# Altium project NG2093.PrjPcb (part 10 of 10)
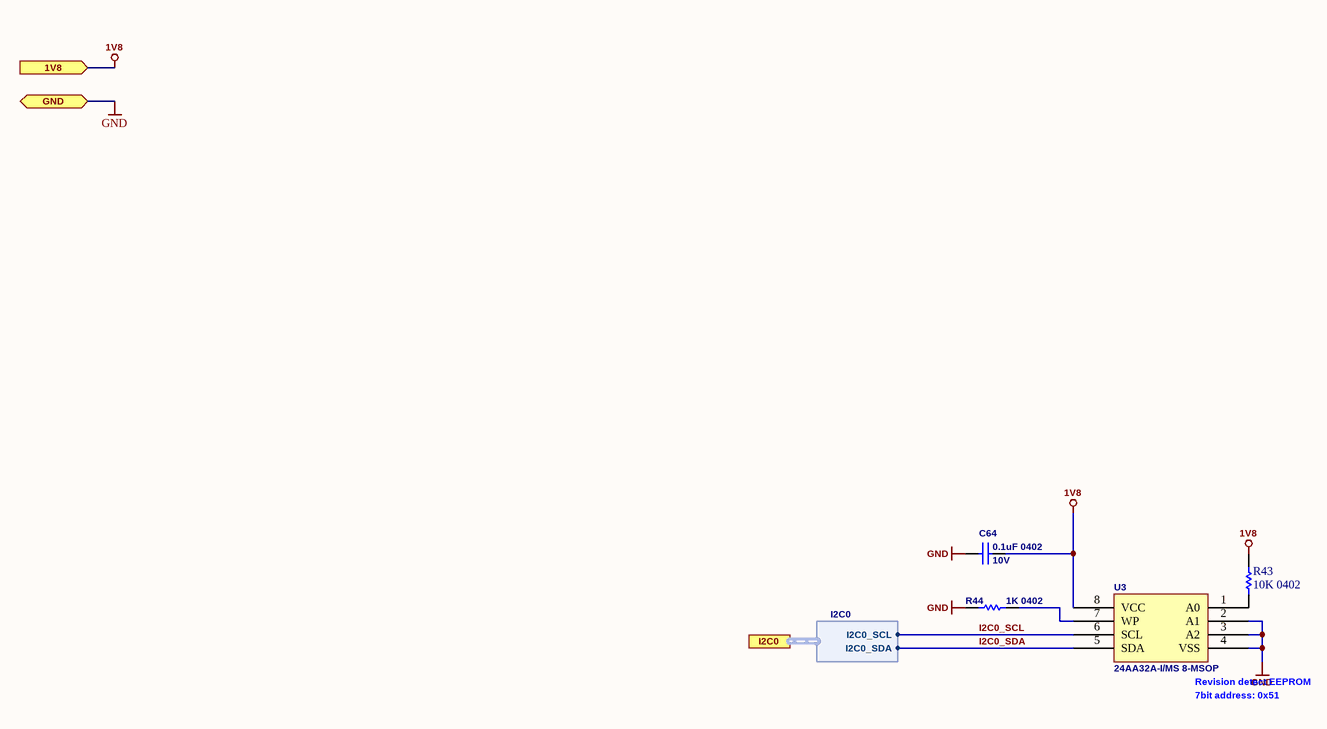
[diagram p18: NG9093_EEPROM.SchDoc]

## Nets that join several sheets
1V2: POWER_GEN (R64.2), Ethernet_Switch (20 pins)
1V8: CONNECTOR_B (C65.2 U11.5), ETH_PCIE_PHY (C52.2 R50.2 U6.3), BOOT_JTAG_AUX (9 pins), POWER_GEN (C63.2 TP3.1 U8.5), NG2093_IMU (8 pins), NG9093_EEPROM (C64.2 R43.2 U3.8)
2V5: POWER_GEN (R94.2), Ethernet_Switch (10 pins)
3V3: ETH_PCIE_PHY (21 pins), NG2093_USB (7 pins), BOOT_JTAG_AUX (C55.2 J4.9 J7.4), POWER_GEN (15 pins), NG2093_IMU (C90.2 C91.2 U12.3), RJ45_1 (J1.15 J1.17), RJ45_2 (J10.15 J10.17), NG2093_CAM_2Lane (J6.25 J6.26 J8.25 J8.26), Ethernet_Switch (21 pins), PoE_Si3404 (R57.2), NG2093_CAM_4Lane (J9.25 J9.26 J11.25 J11.26)
5V_PoE: CONNECTOR_B (8 pins), CONNECTOR_A (J12.1), BOOT_JTAG_AUX (R53.2 R54.2 R55.2 R56.2), POWER_GEN (8 pins), PoE_Si3404 (7 pins)
GND: TopLevel (6 pins), CONNECTOR_B (29 pins), CONNECTOR_A (28 pins), ETH_PCIE_PHY (24 pins), NG2093_USB (26 pins), BOOT_JTAG_AUX (21 pins), POWER_GEN (24 pins), NG2093_IMU (10 pins), RJ45_1 (7 pins), RJ45_2 (7 pins), NG2093_CAM_2Lane (26 pins), Ethernet_Switch (65 pins), PoE_Si3404 (10 pins), NG2093_CAM_4Lane (32 pins), NG9093_EEPROM (5 pins)
VBUS: CONNECTOR_B (J3.80), NG2093_USB (14 pins)
VNEG_IN: RJ45_1 (6 pins), PoE_Si3404 (C33.1 FB3.1 NT1.1)
2485_BOOT_SEL: CONNECTOR_A (J12.4), BOOT_JTAG_AUX (B2.2 R102.2 R103.2)
2485_PGOOD: CONNECTOR_A (J2.37), BOOT_JTAG_AUX (J5.5 Q2.1)
2485_WAKEUP: CONNECTOR_A (J2.41), BOOT_JTAG_AUX (J5.7 R1.2 R62.2)
BNO08x_BOOTN_1V8: CONNECTOR_B (J3.42), NG2093_IMU (R84.2)
BNO08x_CIPO_1V8: CONNECTOR_A (J2.64 TP28.1), NG2093_IMU (U12.20)
BNO08x_COPI_1V8: CONNECTOR_A (J2.62 TP29.1), NG2093_IMU (U12.17)
BNO08x_CS_1V8: CONNECTOR_A (J2.60 TP30.1), NG2093_IMU (R95.2 U12.18)
BNO08x_INT_1V8: CONNECTOR_A (J2.69), NG2093_IMU (TP25.1 U12.14)
BNO08x_RSTn_1V8: CONNECTOR_B (J3.44), NG2093_IMU (TP19.1 U12.11)
BNO08x_SCK_1V8: CONNECTOR_A (J2.74 TP27.1), NG2093_IMU (U12.19)
BOOT0: CONNECTOR_B (J3.26), BOOT_JTAG_AUX (R23.1 R38.2 SW1.6)
BOOT1: CONNECTOR_B (J3.24), BOOT_JTAG_AUX (R22.1 R37.2 SW1.5)
BOOT2: CONNECTOR_B (J3.22), BOOT_JTAG_AUX (R21.1 R36.2 SW1.4)
BOOT3: CONNECTOR_B (J3.20), BOOT_JTAG_AUX (R20.1 R35.2 SW1.3)
BOOT4: CONNECTOR_B (J3.18), BOOT_JTAG_AUX (R19.1 R34.2 SW1.2)
CAM2_RST: CONNECTOR_B (J3.72), NG2093_CAM_4Lane (D12.4 D12.7 J11.17 TP16.1)
CAM_A_CLK_OUT: CONNECTOR_A (J2.28), NG2093_CAM_4Lane (7 pins)
CAM_A_PWDN_N: CONNECTOR_A (J2.34), NG2093_CAM_4Lane (D27.4 D27.7 J9.17 TP37.1)
CAM_B_CLK_OUT: CONNECTOR_A (J2.73), NG2093_CAM_2Lane (8 pins)
CAM_B_D_PWM: CONNECTOR_A (J2.65), NG2093_CAM_2Lane (D28.4 D28.7 J8.17 TP36.1)
CAM_B_PWDN_N: CONNECTOR_A (J2.67), NG2093_CAM_2Lane (D24.4 D24.7 J6.17 TP35.1)
CAM_L_C_N: CONNECTOR_A (J2.95), NG2093_CAM_2Lane (D24.1 D24.10 J6.8)
CAM_L_C_P: CONNECTOR_A (J2.97), NG2093_CAM_2Lane (D24.2 D24.9 J6.9)
CAM_L_D0_N: CONNECTOR_A (J2.89), NG2093_CAM_2Lane (D22.1 D22.10 J6.2)
CAM_L_D0_P: CONNECTOR_A (J2.91), NG2093_CAM_2Lane (D22.2 D22.9 J6.3)
CAM_L_D1_N: CONNECTOR_A (J2.83), NG2093_CAM_2Lane (D22.4 D22.7 J6.5)
CAM_L_D1_P: CONNECTOR_A (J2.85), NG2093_CAM_2Lane (D22.5 D22.6 J6.6)
CAM_R_C_N: CONNECTOR_A (J2.96), NG2093_CAM_2Lane (D28.1 D28.10 J8.8)
CAM_R_C_P: CONNECTOR_A (J2.98), NG2093_CAM_2Lane (D28.2 D28.9 J8.9)
CAM_R_D0_N: CONNECTOR_A (J2.90), NG2093_CAM_2Lane (D26.1 D26.10 J8.2)
CAM_R_D0_P: CONNECTOR_A (J2.92), NG2093_CAM_2Lane (D26.2 D26.9 J8.3)
CAM_R_D1_N: CONNECTOR_A (J2.84), NG2093_CAM_2Lane (D26.4 D26.7 J8.5)
CAM_R_D1_P: CONNECTOR_A (J2.86), NG2093_CAM_2Lane (D26.5 D26.6 J8.6)
COM_AUX_IO2: CONNECTOR_B (U11.1), CONNECTOR_A (R82.1 R100.1), NG2093_CAM_2Lane (R79.1 R80.1)
FSIN_4LANE: CONNECTOR_B (R99.1 U11.2), CONNECTOR_A (R101.1), NG2093_CAM_4Lane (R77.1 R81.1)
GPIO7/sd_hst_cd: CONNECTOR_A (J2.59), BOOT_JTAG_AUX (R66.2)
GPIO58: CONNECTOR_B (J3.28 R27.1), BOOT_JTAG_AUX (R33.2 R63.1 SW1.1)
I2C0_SCL: CONNECTOR_B (J3.34), BOOT_JTAG_AUX (TP1.1), NG9093_EEPROM (U3.6)
I2C0_SDA: CONNECTOR_B (J3.36), BOOT_JTAG_AUX (TP2.1), NG9093_EEPROM (U3.5)
I2C1_SCL: CONNECTOR_A (J2.35), NG2093_CAM_4Lane (J9.20)
I2C1_SDA: CONNECTOR_A (J2.33), NG2093_CAM_4Lane (J9.21)
I2C2_SCL: CONNECTOR_A (J2.77), NG2093_CAM_2Lane (J6.20 J8.20)
I2C2_SDA: CONNECTOR_A (J2.79), NG2093_CAM_2Lane (J6.21 J8.21)
I2C3_SCL: CONNECTOR_A (J2.78), BOOT_JTAG_AUX (J5.2), NG2093_CAM_4Lane (J11.20)
I2C3_SDA: CONNECTOR_A (J2.80), BOOT_JTAG_AUX (J5.4), NG2093_CAM_4Lane (J11.21)
LED0_0: ETH_PCIE_PHY (R74.1), Ethernet_Switch (U7.A79)
LED0_1: ETH_PCIE_PHY (R73.1), Ethernet_Switch (U7.B69)
LED0_2: ETH_PCIE_PHY (R87.1), Ethernet_Switch (U7.A80)
LED1_1: RJ45_1 (R58.1), Ethernet_Switch (U7.A81)
LED1_2: RJ45_1 (R59.1), Ethernet_Switch (U7.B71)
LED2_1: RJ45_2 (R97.1), Ethernet_Switch (U7.B72)
LED2_2: RJ45_2 (R98.1), Ethernet_Switch (U7.A83)
MIPI2_C_N: CONNECTOR_A (J2.4), NG2093_CAM_4Lane (D11.1 D11.10 J11.8)
MIPI2_C_P: CONNECTOR_A (J2.6), NG2093_CAM_4Lane (D11.2 D11.9 J11.9)
MIPI2_D0_N: CONNECTOR_A (J2.10), NG2093_CAM_4Lane (D10.1 D10.10 J11.2)
MIPI2_D0_P: CONNECTOR_A (J2.12), NG2093_CAM_4Lane (D10.2 D10.9 J11.3)
MIPI2_D1_N: CONNECTOR_A (J2.16), NG2093_CAM_4Lane (D10.4 D10.7 J11.5)
MIPI2_D1_P: CONNECTOR_A (J2.18), NG2093_CAM_4Lane (D10.5 D10.6 J11.6)
MIPI2_D2_N: CONNECTOR_A (J2.22), NG2093_CAM_4Lane (D11.4 D11.7 J11.11)
MIPI2_D2_P: CONNECTOR_A (J2.24), NG2093_CAM_4Lane (D11.5 D11.6 J11.12)
MIPI2_D3_N: CONNECTOR_A (J2.46), NG2093_CAM_4Lane (D12.1 D12.10 J11.14)
MIPI2_D3_P: CONNECTOR_A (J2.48), NG2093_CAM_4Lane (D12.2 D12.9 J11.15)
MIPI_C_N: CONNECTOR_A (J2.3), NG2093_CAM_4Lane (D25.1 D25.10 J9.8)
MIPI_C_P: CONNECTOR_A (J2.5), NG2093_CAM_4Lane (D25.2 D25.9 J9.9)
MIPI_D0_N: CONNECTOR_A (J2.9), NG2093_CAM_4Lane (D23.1 D23.10 J9.2)
MIPI_D0_P: CONNECTOR_A (J2.11), NG2093_CAM_4Lane (D23.2 D23.9 J9.3)
MIPI_D1_N: CONNECTOR_A (J2.15), NG2093_CAM_4Lane (D23.4 D23.7 J9.5)
MIPI_D1_P: CONNECTOR_A (J2.17), NG2093_CAM_4Lane (D23.5 D23.6 J9.6)
MIPI_D2_N: CONNECTOR_A (J2.21), NG2093_CAM_4Lane (D25.4 D25.7 J9.11)
MIPI_D2_P: CONNECTOR_A (J2.23), NG2093_CAM_4Lane (D25.5 D25.6 J9.12)
MIPI_D3_N: CONNECTOR_A (J2.27), NG2093_CAM_4Lane (D27.1 D27.10 J9.14)
MIPI_D3_P: CONNECTOR_A (J2.29), NG2093_CAM_4Lane (D27.2 D27.9 J9.15)
MODULE_nRST: CONNECTOR_A (B1.2 J2.39 J12.3), BOOT_JTAG_AUX (J5.1 Q4.1)
PCIe_CLKREQ_N_1V8: CONNECTOR_B (J3.65), ETH_PCIE_PHY (U6.4)
PCIe_ISOLATE_N_1V8: CONNECTOR_B (R27.2), ETH_PCIE_PHY (U6.5)
PCIe_PERST_1V8: CONNECTOR_B (J3.63), ETH_PCIE_PHY (Q1.1)
sd_hst0_clk: CONNECTOR_A (J2.61), BOOT_JTAG_AUX (J7.5)
sd_hst0_cmd: CONNECTOR_A (J2.63), BOOT_JTAG_AUX (J7.3)
sd_hst0_dat_0: CONNECTOR_A (J2.40), BOOT_JTAG_AUX (J7.7)
sd_hst0_dat_1: CONNECTOR_A (J2.38), BOOT_JTAG_AUX (J7.8)
sd_hst0_dat_2: CONNECTOR_A (J2.36), BOOT_JTAG_AUX (J7.1)
sd_hst0_dat_3: CONNECTOR_A (J2.32), BOOT_JTAG_AUX (J7.2)
SDS_REF_CLK_N: CONNECTOR_B (R6.1 R30.1), ETH_PCIE_PHY (U4.16)
SDS_REF_CLK_P: CONNECTOR_B (R25.1 R26.2), ETH_PCIE_PHY (U4.15)
SDS_RXD_N: CONNECTOR_B (J3.77), ETH_PCIE_PHY (C51.1)
SDS_RXD_P: CONNECTOR_B (J3.75), ETH_PCIE_PHY (C35.1)
SDS_TXD_N: CONNECTOR_B (J3.71), ETH_PCIE_PHY (U4.14)
SDS_TXD_P: CONNECTOR_B (J3.69), ETH_PCIE_PHY (U4.13)
STROBE1: CONNECTOR_A (J12.2), NG2093_CAM_2Lane (J6.24 TP23.1)
SYS_RST: CONNECTOR_B (J3.89), BOOT_JTAG_AUX (J4.6)
TCK: CONNECTOR_B (J3.97), BOOT_JTAG_AUX (J4.2)
TDI: CONNECTOR_B (J3.95), BOOT_JTAG_AUX (J4.3)
TDO: CONNECTOR_B (J3.91), BOOT_JTAG_AUX (J4.5)
TMS: CONNECTOR_B (J3.99), BOOT_JTAG_AUX (J4.1)
TRST: CONNECTOR_B (J3.93), BOOT_JTAG_AUX (J4.4)
TXRX0A_N: ETH_PCIE_PHY (U4.2), Ethernet_Switch (U7.A4)
TXRX0A_P: ETH_PCIE_PHY (U4.1), Ethernet_Switch (U7.B2)
TXRX0B_N: ETH_PCIE_PHY (U4.5), Ethernet_Switch (U7.B4)
TXRX0B_P: ETH_PCIE_PHY (U4.4), Ethernet_Switch (U7.A5)
TXRX0C_N: ETH_PCIE_PHY (U4.7), Ethernet_Switch (U7.A7)
TXRX0C_P: ETH_PCIE_PHY (U4.6), Ethernet_Switch (U7.B5)
TXRX0D_N: ETH_PCIE_PHY (U4.10), Ethernet_Switch (U7.B7)
TXRX0D_P: ETH_PCIE_PHY (U4.9), Ethernet_Switch (U7.A8)
TXRX1A_N: RJ45_1 (D17.2 D17.9 J1.2), Ethernet_Switch (U7.B13)
TXRX1A_P: RJ45_1 (D17.1 D17.10 J1.1), Ethernet_Switch (U7.A14)
TXRX1B_N: RJ45_1 (D17.5 D17.6 J1.6), Ethernet_Switch (U7.A16)
TXRX1B_P: RJ45_1 (D17.4 D17.7 J1.3), Ethernet_Switch (U7.B14)
TXRX1C_N: RJ45_1 (D18.2 D18.9 J1.8), Ethernet_Switch (U7.B16)
TXRX1C_P: RJ45_1 (D18.1 D18.10 J1.7), Ethernet_Switch (U7.A17)
TXRX1D_N: RJ45_1 (D18.5 D18.6 J1.10), Ethernet_Switch (U7.A19)
TXRX1D_P: RJ45_1 (D18.4 D18.7 J1.9), Ethernet_Switch (U7.B17)
TXRX2A_N: RJ45_2 (D30.2 D30.9 J10.2), Ethernet_Switch (U7.A25)
TXRX2A_P: RJ45_2 (D30.1 D30.10 J10.1), Ethernet_Switch (U7.B20)
TXRX2B_N: RJ45_2 (D30.5 D30.6 J10.6), Ethernet_Switch (U7.B22)
TXRX2B_P: RJ45_2 (D30.4 D30.7 J10.3), Ethernet_Switch (U7.A26)
TXRX2C_N: RJ45_2 (D31.2 D31.9 J10.8), Ethernet_Switch (U7.A28)
TXRX2C_P: RJ45_2 (D31.1 D31.10 J10.7), Ethernet_Switch (U7.B23)
TXRX2D_N: RJ45_2 (D31.5 D31.6 J10.10), Ethernet_Switch (U7.B25)
TXRX2D_P: RJ45_2 (D31.4 D31.7 J10.9), Ethernet_Switch (U7.A29)
USB_D_N: CONNECTOR_B (J3.90), NG2093_USB (J14.A7 J14.B7)
USB_D_P: CONNECTOR_B (J3.92), NG2093_USB (J14.A6 J14.B6)
USB_RX_N: CONNECTOR_B (J3.96), NG2093_USB (U61.4)
USB_RX_P: CONNECTOR_B (J3.98), NG2093_USB (U61.3)
USB_TX_N: CONNECTOR_B (J3.84), NG2093_USB (U61.8)
USB_TX_P: CONNECTOR_B (J3.86), NG2093_USB (U61.7)
VNEG_OUT: RJ45_2 (J10.12 J10.14), PoE_Si3404 (NT1.2 U10.3)
VPOS_IN: RJ45_1 (6 pins), PoE_Si3404 (C33.2 FB2.1 Q5.4 R51.1)
VPOS_OUT: RJ45_2 (J10.11 J10.13), PoE_Si3404 (Q5.1 Q5.2 Q5.5 Q5.6)
WAKE: CONNECTOR_B (J3.52), NG2093_IMU (U12.6)

## Assembly variants
Production: not fitted L5 R1 R2 R7 R9 R22 R23 R47 R60 R66 R67 R90 R92 R93 R94 SW1